# Altium project Cabinet.PrjPCB (part 2 of 2)

## Sheet DownLoad.SchDoc
size A4
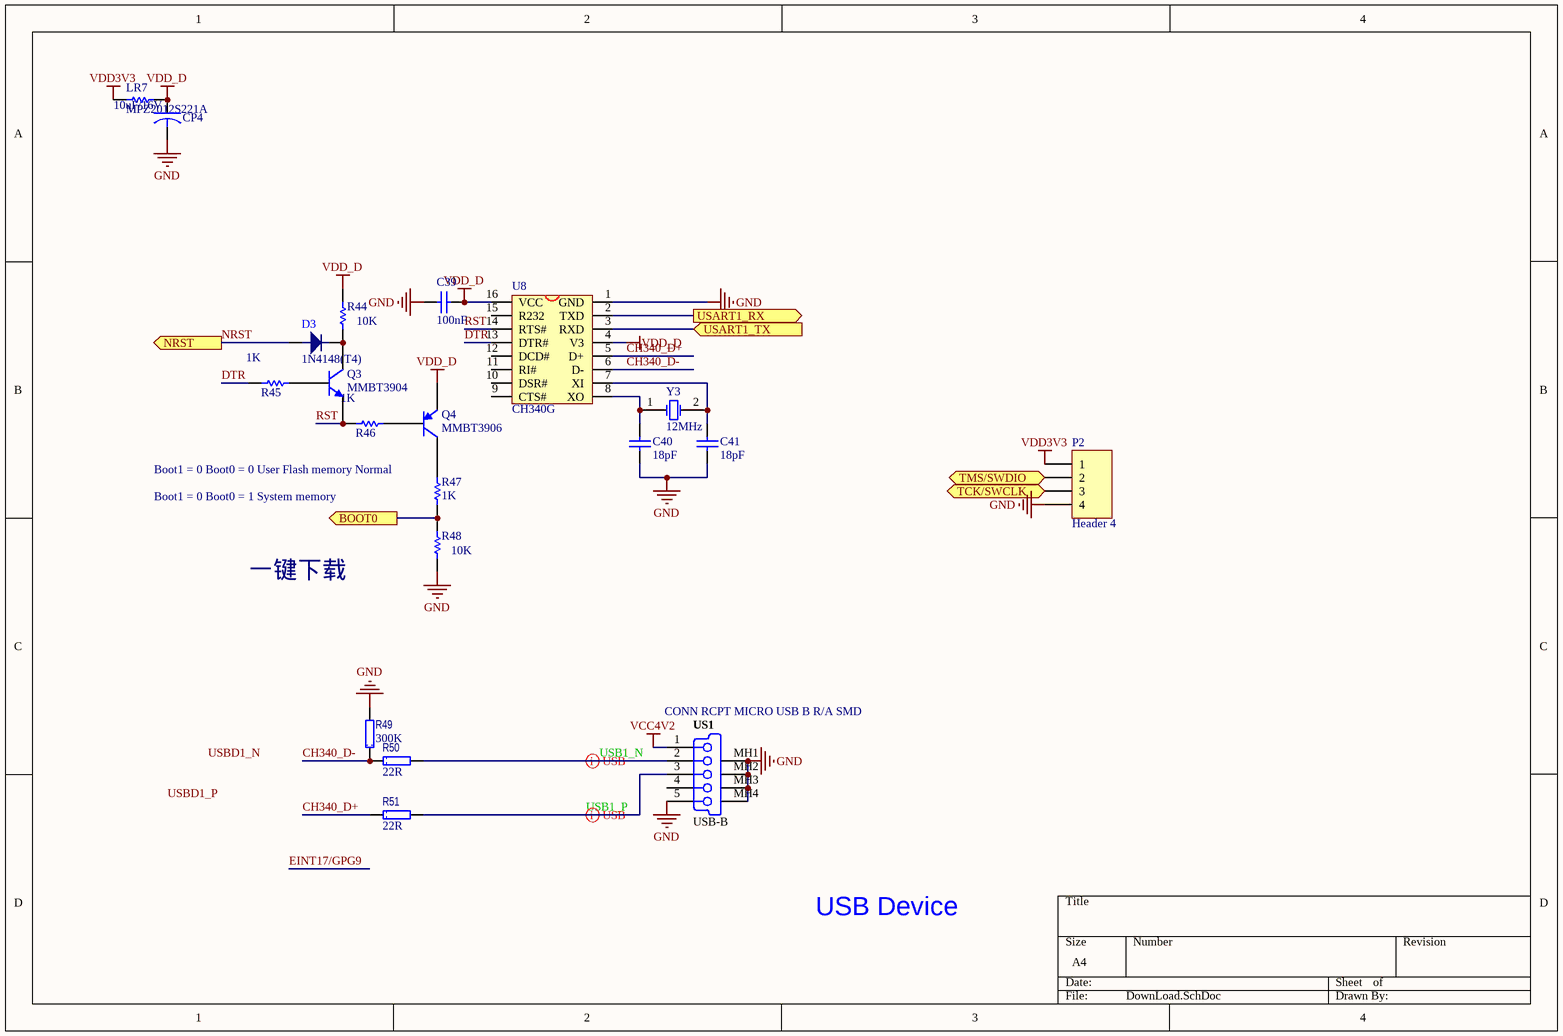
[diagram p5: DownLoad.SchDoc]

### Parts
C39  value 100nF  [2012[0805]06CD]  (hidden comment: CAP 100nF 50V 0805(2012))
C40  value 18pF  [2012[0805]100_L]  (hidden comment: CAP 18pF 50V 0805(2012))
C41  value 18pF  [2012[0805]100_L]  (hidden comment: CAP 18pF 50V 0805(2012))
CP4  value 10uF/16V  [3216[1206]CB]  (hidden comment: TAJA106K016RNJ)
D3  1N4148(T4)  [SOD123]
LR7  MPZ2012S221A  [2012[0805]RL]
P2  Header 4  [HDR1X4]
Q3  MMBT3904  [SOT23_N]
Q4  MMBT3906  [SOT23B_N]
R44  value 10K  [2012[0805]R]  (hidden comment: 10K 1% 0805(2012))
R45  value 1K  [2012[0805]R]  (hidden comment: 1K 1% 0805(2012))
R46  value 1K  [2012[0805]R]  (hidden comment: 1K 1% 0805(2012))
R47  value 1K  [2012[0805]R]  (hidden comment: 1K 1% 0805(2012))
R48  value 10K  [2012[0805]R]  (hidden comment: 10K 1% 0805(2012))
R49  value 300K  [2012[0805]R]  (hidden comment: CRCW0603300KFKEA)
R50  value 22R  [2012[0805]R]  (hidden comment: CRCW060322R0FKEA)
R51  value 22R  [2012[0805]R]  (hidden comment: CRCW060322R0FKEA)
U8  CH340G  [SOIC16_N]
US1  USB-B  Description 1: CONN RCPT MICRO USB B R/A SMD  [USB_micro_AB]
Y3  12MHz  [XTAL_HC-49]

### Ports
BOOT0 (out), NRST (out), TCK/SWCLK (in), TMS/SWDIO (bidir), USART1_RX (out), USART1_TX (in)

### Nets
GND: C39.2 C40.2 C41.2 CP4.2 P2.4 R48.1 R49.2 U8.1(GND) US1.5 US1.MH1 US1.MH2 US1.MH3 US1.MH4
VCC4V2: US1.1
VDD3V3: LR7.1 P2.1
VDD_D: C39.1 CP4.1 LR7.2 Q4.2(E) R44.2 U8.4(V3) U8.16(VCC)
CH340_D+: R51.1 U8.5(D+)
CH340_D-: R49.1 R50.1 U8.6(D-)
DTR: R45.1 U8.13(DTR#)
NRST: D3.1 ; port NRST
RST: Q3.2(E) R46.1 U8.14(RTS#)
USB1_N: R50.2 US1.2
USB1_P: R51.2 US1.3
NetC40_1: C40.1 U8.8(XO) Y3.1(OSC1)
NetC41_1: C41.1 U8.7(XI) Y3.2(OSC2)
NetD3_2: D3.2 Q3.3(C) R44.1
NetP2_2: P2.2 ; port TMS/SWDIO
NetP2_3: P2.3 ; port TCK/SWCLK
NetQ3_1: Q3.1(B) R45.2
NetQ4_1: Q4.1(B) R46.2
NetQ4_3: Q4.3(C) R47.2
NetR47_1: R47.1 R48.2 ; port BOOT0
NetU8_2: U8.2(TXD) ; port USART1_RX
NetU8_3: U8.3(RXD) ; port USART1_TX

Not connected (* = marked no-connect by the designer): U8 9(CTS#) 10(DSR#) 11(RI#) 12(DCD#) 15(R232); US1 4

### Layout directives
differential pair: USB1_N, USB1_P

### Notes on the sheet
- Boot1 = 0 Boot0 = 0 User Flash memory Normal
- Boot1 = 0 Boot0 = 1 System memory
- 一键下载
- USB Device
- Labels drawn without touching a wire or pin: USBD1_N, USBD1_P

### Library data of the parts
C39 = CMP-1036-04418-1: CAP 100nF 50V ±5% 0805 (2012 Metric) Thickness 1mm SMD; Case-EIA: 0805; Case-Metric: 2012; Tolerance: ±5%; Max Thickness: 1 mm; Technology: SMT; Rated Voltage: 50 V
C40 C41 = CMP-1036-01136-1: CAP 18pF 50V ±1% 0805 (2012 Metric) Thickness 0.75mm SMD; Case-EIA: 0805; Case-Metric: 2012; Technology: SMT; Tolerance: ±1%; Max Thickness: 0.75 mm; Rated Voltage: 50 V
CP4 = CAPACITOR: 钽质电容器-固体SMD 16volts 10uF 10%; Manufacturer: AVX; ESR: 3 Ohms; 产品: Tantalum Solid Standard Grade - Other Various; 产品种类: SMD Tantalum Capacitors; 制造商库存号: A Case; 外壳代码 - in: 1206; 外壳代码 - mm: 3216; 封装 / 箱体: 1206 (3216 metric); 封装: Reel; 尺寸: 1.6 mm W x 3.2 mm L; 工作温度范围: - 55 C to + 125 C; 损耗因数 DF: 8; 标准包装数量: 2000; 漏泄电流: 1.6 uA; 电压额定值: 16 V; 端接类型: SMD/SMT; 系列: TAJ; 高度: 1.8 mm; Category: 钽质电容器-固体SMD; ComponentLink1Description: http://www.avx.com/docs/Catalogs/taj.pdf; ComponentLink1URL: http://www.avx.com/docs/Catalogs/taj.pdf; Description 1: 钽质电容器-固体SMD 16volts 10uF 10%; Manufacturer Part Number: TAJA106K016RNJ; Minimum Order Quantity: 1; Pricing 1: 1=0.600, 100=0.280, 200=0.250, 500=0.221, 1000=0.200, 2000=0.140, 5000=0.131, 10000=0.124, 25000=0.103 (USD); Reeling: True; RoHS - 贸泽: Y; RoHS: RoHS Compliant; Stock 1: 20335; Supplier 1: Mouser; Supplier Part Number 1: 581-TAJA106K016R; 制造商: AVX; 容差: 10 %; 电容: 10 uF
D3 = 1N4148: 高速开关二极管
LR7 = Res Semi: 电磁干扰滤波珠子、扼流圈和阵列 Ferrite Chip Beads; Manufacturer: TDK; 阻抗: 220 Ohms; 最大直流电流: 3 A; 最大直流电阻: 0.04 Ohms; 工作温度范围: - 55 C to + 125 C; 封装 / 箱体: 2012; 封装: Reel; 端接类型: SMD/SMT; 容差: 25 %; 产品种类: Ferrite Beads; 标准包装数量: 4000; Supplier 1: Mouser; Supplier Part Number 1: 810-MPZ2012S221A; Manufacturer Part Number: MPZ2012S221A; RoHS: RoHS Compliant; Description 1: 电磁干扰滤波珠子、扼流圈和阵列 Ferrite Chip Beads; Category: 电磁干扰滤波珠子、扼流圈和阵列; Stock 1: 26540; Pricing 1: 1=0.070, 50=0.060, 100=0.053, 500=0.040, 1000=0.035, 4000=0.031, 8000=0.029, 12000=0.025 (USD); 制造商: TDK; RoHS - 贸泽: Y; Minimum Order Quantity: 1; Reeling: True; ComponentLink1URL: http://www.mouser.com/ds/2/400/e9413_mpz-24582.pdf; ComponentLink1Description: http://www.mouser.com/ds/2/400/e9413_mpz-24582.pdf
P2 = Header 4: Header, 4-Pin; LatestRevisionDate: 17-Jul-2002; LatestRevisionNote: Re-released for DXP Platform.; Publisher: Altium Limited
Q3 = MMBT3904: NPN Switching Transistor; Published: 17-Sep-2003; LatestRevisionDate: 12-Dec-2006; LatestRevisionNote: IPC-7351 Footprint Added.; DatasheetVersion: 13-May-2002; PackageVersion: May-1999; PackageReference: SOT23; Publisher: Altium Limited; PackageDescription: 3-Pin SOT-23 Package 0.95 mm Pitch, 2.3 mm Lead Span; ComponentLink1Description: Manufacturer Link; ComponentLink1URL: http://www.semiconductors.philips.com/; ComponentLink2Description: Datasheet; ComponentLink2URL: http://www.semiconductors.philips.com/acrobat/datasheets/MMBT3904_4.pdf
Q4 = MMBT3906: PNP Switching Transistor; Published: 17-Sep-2003; LatestRevisionDate: 12-Dec-2006; LatestRevisionNote: IPC-7351 Footprint Added.; DatasheetVersion: 11-Apr-2000; PackageVersion: May-1999; PackageReference: SOT23; Publisher: Altium Limited; PackageDescription: 3-Pin SOT-23 Package 0.95 mm Pitch, 2.3 mm Lead Span; ComponentLink1Description: Manufacturer Link; ComponentLink1URL: http://www.semiconductors.philips.com/; ComponentLink2Description: Datasheet; ComponentLink2URL: http://www.semiconductors.philips.com/acrobat/datasheets/MMBT3906_2.pdf
R44 R48 = CMP-1013-00623-1: 10K 0.125W 1% 0805 (2012 Metric)  SMD; Case-Metric: 2012; Case-EIA: 0805; Tolerance: 1 %; Power: 0.125 W; Technology: SMT
R45-R47 = CMP-1013-00510-1: 1K 0.125W 1% 0805 (2012 Metric)  SMD; Case-Metric: 2012; Case-EIA: 0805; Tolerance: 1 %; Power: 0.125 W; Technology: SMT
R49 = RES: 厚膜电阻器 - SMD 1/10watt 300Kohms 1%; Manufacturer: Vishay / Dale; 尺寸: 0.85 mm W x 1.55 mm L x 0.45 mm H; 工作温度范围: - 55 C to + 155 C; 封装 / 箱体: 0603 (1608 metric); 封装: Reel; 功率额定值: 100 mW; 产品: Thick Film Resistors SMD; 系列: CRCW; 温度系数: 100 PPM / K; 端接类型: SMD/SMT; 电压额定值: 75 V; 外壳代码 - in: 0603; 外壳代码 - mm: 1608; 制造商: Vishay; 产品种类: 0603 Thick Film Chip Resistors; 标准包装数量: 5000; Supplier 1: Mouser; Supplier Part Number 1: 71-CRCW0603-300K-E3; Manufacturer Part Number: CRCW0603300KFKEA; RoHS: RoHS Compliant By Exemption; Category: 厚膜电阻器 - SMD; Stock 1: 19604; Pricing 1: 1=0.080, 10=0.013, 100=0.010, 1000=0.008, 5000=0.005, 25000=0.004, 50000=0.003 (USD); 电阻: 300 kOhms; 容差: 1 %; RoHS - 贸泽: E; Minimum Order Quantity: 1; Reeling: True; ComponentLink1URL: http://www.mouser.com/ds/2/427/dcrcwe3-109170.pdf; ComponentLink1Description: http://www.mouser.com/ds/2/427/dcrcwe3-109170.pdf; Description 1: 厚膜电阻器 - SMD 1/10watt 300Kohms 1%
R50 R51 = RES: 厚膜电阻器 - SMD 1/10watt 22ohms 1%; Manufacturer: Vishay / Dale; 尺寸: 0.85 mm W x 1.55 mm L x 0.45 mm H; 工作温度范围: - 55 C to + 155 C; 封装 / 箱体: 0603 (1608 metric); 封装: Reel; 功率额定值: 100 mW; 产品: Thick Film Resistors SMD; 系列: CRCW; 温度系数: 100 PPM / K; 端接类型: SMD/SMT; 电压额定值: 75 V; 制造商: Vishay; 标准包装数量: 5000; 外壳代码 - in: 0603; 外壳代码 - mm: 1608; 产品种类: 0603 Thick Film Chip Resistors; Supplier 1: Mouser; Supplier Part Number 1: 71-CRCW0603-22-E3; Manufacturer Part Number: CRCW060322R0FKEA; RoHS: RoHS Compliant By Exemption; Category: 厚膜电阻器 - SMD; Stock 1: 35802; 电阻: 22 Ohms; 容差: 1 %; Minimum Order Quantity: 1; Reeling: True; ComponentLink1URL: http://www.mouser.com/ds/2/427/dcrcwe3-109170.pdf; ComponentLink1Description: http://www.mouser.com/ds/2/427/dcrcwe3-109170.pdf; Description 1: 厚膜电阻器 - SMD 1/10watt 22ohms 1%; Pricing 1: 1=0.080, 10=0.013, 100=0.010, 1000=0.008, 5000=0.005, 25000=0.004, 50000=0.003 (USD); RoHS - 贸泽: E
U8 = CH340G: USB2UART
US1 = D-300-0034: USB On-The-Go (OTG) Mini-B Receptacle, Right Angle, SMT, 0.80mm (.031") Pitch, Solder Tabs with Back Cover, Recessed Type; Manufacturer: TE Connectivity; Manufacturer Part Number: 1981568-1; Max Current: mA; Number of Contacts: 5; Specifications: USB 1.0; Connector type: Right Angle; Mounting Technology: Surface Mount; Status: Unreleased; Category: Connector; Supplier 1: Digi-Key; Supplier Part Number 1: A97800TR-ND; RoHS: RoHS Compliant; Stock 1: 12000; Pricing 1: 1000=0.9108, 2000=0.88044, 3000=0.85008, 5000=0.80758, 10000=0.78936 (USD); Packaging: Tape & Reel (TR); Gender: Receptacle; Mounting Type: Surface Mount, Right Angle, Horizontal; Features: -; Ingress Protection: -; ComponentLink1URL: http://www.te.com/commerce/DocumentDelivery/DDEController?Action=srchrtrv&DocNm=1981568&DocType=Customer+Drawing&DocLang=English; ComponentLink1Description: http://www.te.com/commerce/DocumentDelivery/DDEController?Action=srchrtrv&DocNm=1981568&DocType=Customer+Drawing&DocLang=English
Y3 = XTAL: Crystal Oscillator; Published: 8-Jun-2000; LatestRevisionDate: 17-Jul-2002; LatestRevisionNote: Re-released for DXP Platform.; Publisher: Altium Limited

## Nets that join several sheets
GND: CPU (27 pins), Cabinet1 (8 pins), Cabinet2 (8 pins), Cabinet3 (8 pins), Cabinet4 (8 pins), Cabinet5 (8 pins), Cabinet6 (8 pins), Cabinet7 (8 pins), Cabinet8 (8 pins), Cabinet9 (8 pins), Cabinet10 (8 pins), Cabinet11 (8 pins), Cabinet12 (8 pins), Cabinet13 (8 pins), Cabinet14 (8 pins), Cabinet15 (8 pins), Cabinet16 (8 pins), Cabinet17 (8 pins), Cabinet18 (8 pins), Cabinet19 (8 pins), Cabinet20 (8 pins), Cabinet21 (8 pins), Cabinet22 (8 pins), Cabinet23 (8 pins), Cabinet24 (8 pins), TAJ1051T (C47.2 P4.2 U10.2), W5500+HR911105A (30 pins), LM2596 (13 pins), DownLoad (13 pins)
VCC4V2: CPU (CP2.1 U4.3), TAJ1051T (C47.1 U10.3), LM2596 (LR8.2), DownLoad (US1.1)
VCC12V: Cabinet1 (CP5_Cabinet1.1 U11_Cabinet1.3), Cabinet2 (CP5_Cabinet2.1 U11_Cabinet2.3), Cabinet3 (CP5_Cabinet3.1 U11_Cabinet3.3), Cabinet4 (CP5_Cabinet4.1 U11_Cabinet4.3), Cabinet5 (CP5_Cabinet5.1 U11_Cabinet5.3), Cabinet6 (CP5_Cabinet6.1 U11_Cabinet6.3), Cabinet7 (CP5_Cabinet7.1 U11_Cabinet7.3), Cabinet8 (CP5_Cabinet8.1 U11_Cabinet8.3), Cabinet9 (CP5_Cabinet9.1 U11_Cabinet9.3), Cabinet10 (CP5_Cabinet10.1 U11_Cabinet10.3), Cabinet11 (CP5_Cabinet11.1 U11_Cabinet11.3), Cabinet12 (CP5_Cabinet12.1 U11_Cabinet12.3), Cabinet13 (CP5_Cabinet13.1 U11_Cabinet13.3), Cabinet14 (CP5_Cabinet14.1 U11_Cabinet14.3), Cabinet15 (CP5_Cabinet15.1 U11_Cabinet15.3), Cabinet16 (CP5_Cabinet16.1 U11_Cabinet16.3), Cabinet17 (CP5_Cabinet17.1 U11_Cabinet17.3), Cabinet18 (CP5_Cabinet18.1 U11_Cabinet18.3), Cabinet19 (CP5_Cabinet19.1 U11_Cabinet19.3), Cabinet20 (CP5_Cabinet20.1 U11_Cabinet20.3), Cabinet21 (CP5_Cabinet21.1 U11_Cabinet21.3), Cabinet22 (CP5_Cabinet22.1 U11_Cabinet22.3), Cabinet23 (CP5_Cabinet23.1 U11_Cabinet23.3), Cabinet24 (CP5_Cabinet24.1 U11_Cabinet24.3), TAJ1051T (P4.1), LM2596 (5 pins)
VDD: CPU (LR2.2), W5500+HR911105A (10 pins)
VDD3V3: CPU (22 pins), TAJ1051T (U10.5), DownLoad (LR7.1 P2.1)
VDOOR: CPU (LR4.2), Cabinet1 (C48_Cabinet1.1 LED4_Cabinet1.1 Q5_Cabinet1.2 R57_Cabinet1#1.2), Cabinet2 (C48_Cabinet2.1 LED4_Cabinet2.1 Q5_Cabinet2.2 R57_Cabinet2#1.2), Cabinet3 (C48_Cabinet3.1 LED4_Cabinet3.1 Q5_Cabinet3.2 R57_Cabinet3#1.2), Cabinet4 (C48_Cabinet4.1 LED4_Cabinet4.1 Q5_Cabinet4.2 R57_Cabinet4#1.2), Cabinet5 (C48_Cabinet5.1 LED4_Cabinet5.1 Q5_Cabinet5.2 R57_Cabinet5#1.2), Cabinet6 (C48_Cabinet6.1 LED4_Cabinet6.1 Q5_Cabinet6.2 R57_Cabinet6#1.2), Cabinet7 (C48_Cabinet7.1 LED4_Cabinet7.1 Q5_Cabinet7.2 R57_Cabinet7#1.2), Cabinet8 (C48_Cabinet8.1 LED4_Cabinet8.1 Q5_Cabinet8.2 R57_Cabinet8#1.2), Cabinet9 (C48_Cabinet9.1 LED4_Cabinet9.1 Q5_Cabinet9.2 R57_Cabinet9#1.2), Cabinet10 (C48_Cabinet10.1 LED4_Cabinet10.1 Q5_Cabinet10.2 R57_Cabinet10#1.2), Cabinet11 (C48_Cabinet11.1 LED4_Cabinet11.1 Q5_Cabinet11.2 R57_Cabinet11#1.2), Cabinet12 (C48_Cabinet12.1 LED4_Cabinet12.1 Q5_Cabinet12.2 R57_Cabinet12#1.2), Cabinet13 (C48_Cabinet13.1 LED4_Cabinet13.1 Q5_Cabinet13.2 R57_Cabinet13#1.2), Cabinet14 (C48_Cabinet14.1 LED4_Cabinet14.1 Q5_Cabinet14.2 R57_Cabinet14#1.2), Cabinet15 (C48_Cabinet15.1 LED4_Cabinet15.1 Q5_Cabinet15.2 R57_Cabinet15#1.2), Cabinet16 (C48_Cabinet16.1 LED4_Cabinet16.1 Q5_Cabinet16.2 R57_Cabinet16#1.2), Cabinet17 (C48_Cabinet17.1 LED4_Cabinet17.1 Q5_Cabinet17.2 R57_Cabinet17#1.2), Cabinet18 (C48_Cabinet18.1 LED4_Cabinet18.1 Q5_Cabinet18.2 R57_Cabinet18#1.2), Cabinet19 (C48_Cabinet19.1 LED4_Cabinet19.1 Q5_Cabinet19.2 R57_Cabinet19#1.2), Cabinet20 (C48_Cabinet20.1 LED4_Cabinet20.1 Q5_Cabinet20.2 R57_Cabinet20#1.2), Cabinet21 (C48_Cabinet21.1 LED4_Cabinet21.1 Q5_Cabinet21.2 R57_Cabinet21#1.2), Cabinet22 (C48_Cabinet22.1 LED4_Cabinet22.1 Q5_Cabinet22.2 R57_Cabinet22#1.2), Cabinet23 (C48_Cabinet23.1 LED4_Cabinet23.1 Q5_Cabinet23.2 R57_Cabinet23#1.2), Cabinet24 (C48_Cabinet24.1 LED4_Cabinet24.1 Q5_Cabinet24.2 R57_Cabinet24#1.2)
电锁1: CPU (U5.83), Cabinet1 (R60_Cabinet1.2 R61_Cabinet1.1)
电锁2: CPU (U5.87), Cabinet2 (R60_Cabinet2.2 R61_Cabinet2.1)
电锁3: CPU (U5.79), Cabinet3 (R60_Cabinet3.2 R61_Cabinet3.1)
电锁4: CPU (U5.80), Cabinet4 (R60_Cabinet4.2 R61_Cabinet4.1)
电锁5: CPU (U5.88), Cabinet5 (R60_Cabinet5.2 R61_Cabinet5.1)
电锁6: CPU (U5.9), Cabinet6 (R60_Cabinet6.2 R61_Cabinet6.1)
电锁7: CPU (U5.15), Cabinet7 (R60_Cabinet7.2 R61_Cabinet7.1)
电锁8: CPU (U5.38), Cabinet8 (R60_Cabinet8.2 R61_Cabinet8.1)
电锁9: CPU (U5.34), Cabinet9 (R60_Cabinet9.2 R61_Cabinet9.1)
电锁10: CPU (U5.46), Cabinet10 (R60_Cabinet10.2 R61_Cabinet10.1)
电锁11: CPU (U5.39), Cabinet11 (R60_Cabinet11.2 R61_Cabinet11.1)
电锁12: CPU (U5.45), Cabinet12 (R60_Cabinet12.2 R61_Cabinet12.1)
电锁13: CPU (U5.97), Cabinet13 (R60_Cabinet13.2 R61_Cabinet13.1)
电锁14: CPU (U5.1), Cabinet14 (R60_Cabinet14.2 R61_Cabinet14.1)
电锁15: CPU (U5.7), Cabinet15 (R60_Cabinet15.2 R61_Cabinet15.1)
电锁16: CPU (U5.18), Cabinet16 (R60_Cabinet16.2 R61_Cabinet16.1)
电锁17: CPU (U5.55), Cabinet17 (R60_Cabinet17.2 R61_Cabinet17.1)
电锁18: CPU (U5.60), Cabinet18 (R60_Cabinet18.2 R61_Cabinet18.1)
电锁19: CPU (U5.82), Cabinet19 (R60_Cabinet19.2 R61_Cabinet19.1)
电锁20: CPU (U5.3), Cabinet20 (R60_Cabinet20.2 R61_Cabinet20.1)
电锁21: CPU (U5.63), Cabinet21 (R60_Cabinet21.2 R61_Cabinet21.1)
电锁22: CPU (U5.59), Cabinet22 (R60_Cabinet22.2 R61_Cabinet22.1)
电锁23: CPU (U5.66), Cabinet23 (R60_Cabinet23.2 R61_Cabinet23.1)
电锁24: CPU (U5.58), Cabinet24 (R60_Cabinet24.2 R61_Cabinet24.1)
门磁1: CPU (U5.85), Cabinet1 (Q5_Cabinet1.3 R59_Cabinet1.2)
门磁2: CPU (U5.81), Cabinet2 (Q5_Cabinet2.3 R59_Cabinet2.2)
门磁3: CPU (U5.78), Cabinet3 (Q5_Cabinet3.3 R59_Cabinet3.2)
门磁4: CPU (U5.84), Cabinet4 (Q5_Cabinet4.3 R59_Cabinet4.2)
门磁5: CPU (U5.86), Cabinet5 (Q5_Cabinet5.3 R59_Cabinet5.2)
门磁6: CPU (U5.65), Cabinet6 (Q5_Cabinet6.3 R59_Cabinet6.2)
门磁7: CPU (U5.17), Cabinet7 (Q5_Cabinet7.3 R59_Cabinet7.2)
门磁8: CPU (U5.40), Cabinet8 (Q5_Cabinet8.3 R59_Cabinet8.2)
门磁9: CPU (U5.44), Cabinet9 (Q5_Cabinet9.3 R59_Cabinet9.2)
门磁10: CPU (U5.42), Cabinet10 (Q5_Cabinet10.3 R59_Cabinet10.2)
门磁11: CPU (U5.41), Cabinet11 (Q5_Cabinet11.3 R59_Cabinet11.2)
门磁12: CPU (U5.43), Cabinet12 (Q5_Cabinet12.3 R59_Cabinet12.2)
门磁13: CPU (U5.98), Cabinet13 (Q5_Cabinet13.3 R59_Cabinet13.2)
门磁14: CPU (U5.2), Cabinet14 (Q5_Cabinet14.3 R59_Cabinet14.2)
门磁15: CPU (U5.8), Cabinet15 (Q5_Cabinet15.3 R59_Cabinet15.2)
门磁16: CPU (U5.61), Cabinet16 (Q5_Cabinet16.3 R59_Cabinet16.2)
门磁17: CPU (U5.33), Cabinet17 (Q5_Cabinet17.3 R59_Cabinet17.2)
门磁18: CPU (U5.56), Cabinet18 (Q5_Cabinet18.3 R59_Cabinet18.2)
门磁19: CPU (U5.4), Cabinet19 (Q5_Cabinet19.3 R59_Cabinet19.2)
门磁20: CPU (U5.5), Cabinet20 (Q5_Cabinet20.3 R59_Cabinet20.2)
门磁21: CPU (U5.16), Cabinet21 (Q5_Cabinet21.3 R59_Cabinet21.2)
门磁22: CPU (U5.57), Cabinet22 (Q5_Cabinet22.3 R59_Cabinet22.2)
门磁23: CPU (U5.64), Cabinet23 (Q5_Cabinet23.3 R59_Cabinet23.2)
门磁24: CPU (U5.62), Cabinet24 (Q5_Cabinet24.3 R59_Cabinet24.2)